# Altium schematic sheet MM_Motor_Driver.SchDoc
size A; SheetNumber: 3; SheetTotal: 5
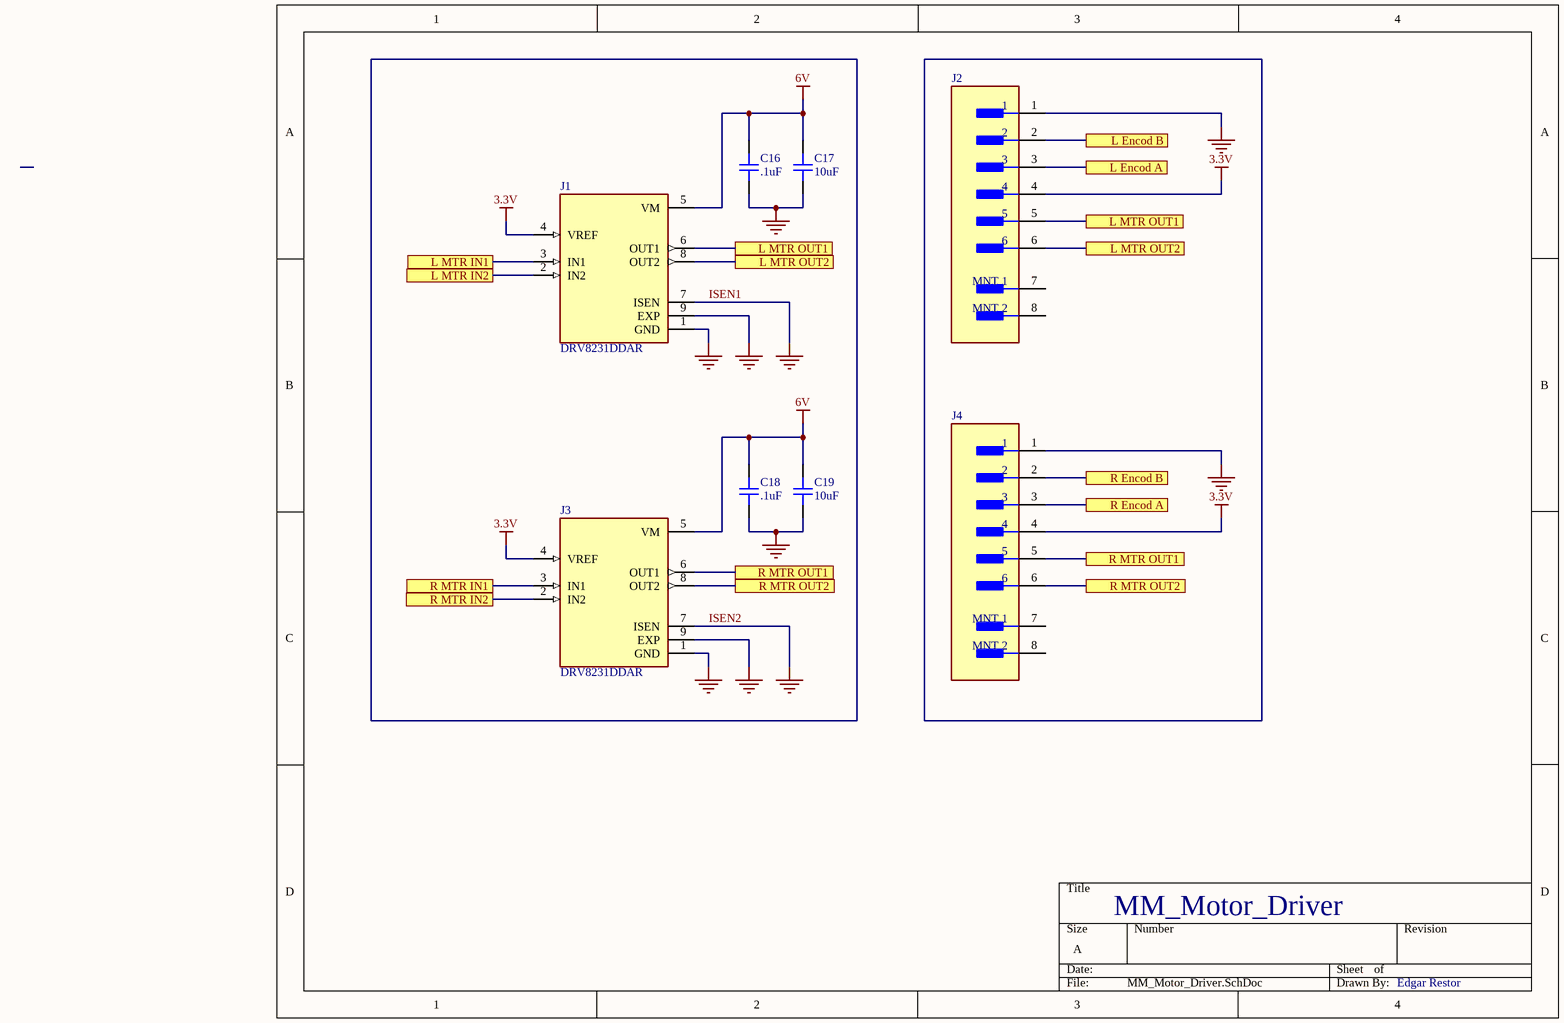
[diagram p0: MM_Motor_Driver.SchDoc]

## Parts
C16  .1uF  [CAP_0603]
C17  10uF  [CAP_0603]
C18  .1uF  [CAP_0603]
C19  10uF  [CAP_0603]
J1  DRV8231DDAR  [IC_DRV8231DDAR]
J2  BM06B-SRSS-TBT(LF)(SN)  [FP-BM06B-SRSS-TBT_LF_SN-MFG]  (value not drawn)
J3  DRV8231DDAR  [IC_DRV8231DDAR]
J4  BM06B-SRSS-TBT(LF)(SN)  [FP-BM06B-SRSS-TBT_LF_SN-MFG]  (value not drawn)

## Ports
L Encod A, L Encod B, L MTR IN1, L MTR IN2, L MTR OUT1, L MTR OUT2, R Encod A, R Encod B, R MTR IN1, R MTR IN2, R MTR OUT1, R MTR OUT2

## Nets
3.3V: J1.4(VREF) J2.4 J3.4(VREF) J4.4
6V: C16.2 C17.2 C18.2 C19.2 J1.5(VM) J3.5(VM)
ISEN1: C16.1 C17.1 C18.1 C19.1 J1.1(GND) J1.7(ISEN) J1.9(EXP) J2.1 J3.1(GND) J3.7(ISEN) J3.9(EXP) J4.1  [also labelled GND, ISEN2]
L Encod A: J2.3 ; port L Encod A
L Encod B: J2.2 ; port L Encod B
L MTR IN1: J1.3(IN1) ; port L MTR IN1
L MTR IN2: J1.2(IN2) ; port L MTR IN2
L MTR OUT1: J1.6(OUT1) J2.5 ; port L MTR OUT1
L MTR OUT2: J1.8(OUT2) J2.6 ; port L MTR OUT2
R Encod A: J4.3 ; port R Encod A
R Encod B: J4.2 ; port R Encod B
R MTR IN1: J3.3(IN1) ; port R MTR IN1
R MTR IN2: J3.2(IN2) ; port R MTR IN2
R MTR OUT1: J3.6(OUT1) J4.5 ; port R MTR OUT1
R MTR OUT2: J3.8(OUT2) J4.6 ; port R MTR OUT2

Not connected (* = marked no-connect by the designer): J2 7(MNT_1) 8(MNT_2); J4 7(MNT_1) 8(MNT_2)

## Notes on the sheet
- MM_Motor_Driver
- Edgar Restor

## Library data of the parts
C16-C19 = CAP_0603: Capacitor SMD 0603; Manufacturer: *; Manufacturer Part Number: *; Distributor Link: *; LCSC: *; Rating: *; Dielectric: *
J1 J3 = DRV8231DDAR: 35-V, 3.7-A H-bridge motor driver with integrated current regulation
J2 J4 = CMP-17439-000255-1: CONN HEADER SMD 6POS 1MM; Voltage Rating: 50V; Number of Positions: 6; Current Rating: 1A; Gender: Male; Contact Resistance: 20mR; Insulation Resistance: 100MR; Mated Stacking Heights: 4.9mm; Number of Rows: 1; Contact Type: Male Pin; Pitch: 1mm; Length: 8mm; Max Operating Temperature: 85°C; Mount: Surface Mount; Material: Polyamide; Depth: 3.6mm; Housing Color: Natural; Orientation: Straight; Termination: Solder; Package Quantity: 1; Min Operating Temperature: -25°C; Contact Shape: Square; Insulation Color: Natural; Connector Type: Header; Max Voltage Rating (DC): 50V; Insulation Material: Nylon; Flammability Rating: UL94 V-0; Color: Natural; Contact Plating: Tin; Lead Free: Lead Free; Packaging: Tape and Reel; Contact Material: Copper Alloy; Series: SR; Housing Material: Polyamide; Contact Finish - Mating: TIN; Max Voltage Rating (AC): 50V; Fastening Type: Pull; Max Current Rating: 1A